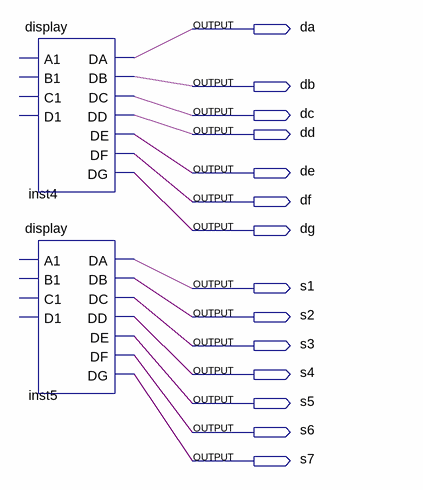
[diagram p0: schematic sheet]
// Quartus schematic counter.bdf as structural Verilog: 2 symbols, 14 pins
module counter (
  output da,
  output db,
  output dc,
  output dd,
  output de,
  output df,
  output dg,
  output s1,
  output s2,
  output s3,
  output s4,
  output s5,
  output s6,
  output s7
);

  display inst4 (.DA(da), .DB(db), .DC(dc), .DD(dd), .DE(de), .DF(df), .DG(dg));  // open: A1, B1, C1, D1
  display inst5 (.DA(s1), .DB(s2), .DC(s3), .DD(s4), .DE(s5), .DF(s6), .DG(s7));  // open: A1, B1, C1, D1
endmodule
